# EAGLE design usb2can (EAGLE 6.3)
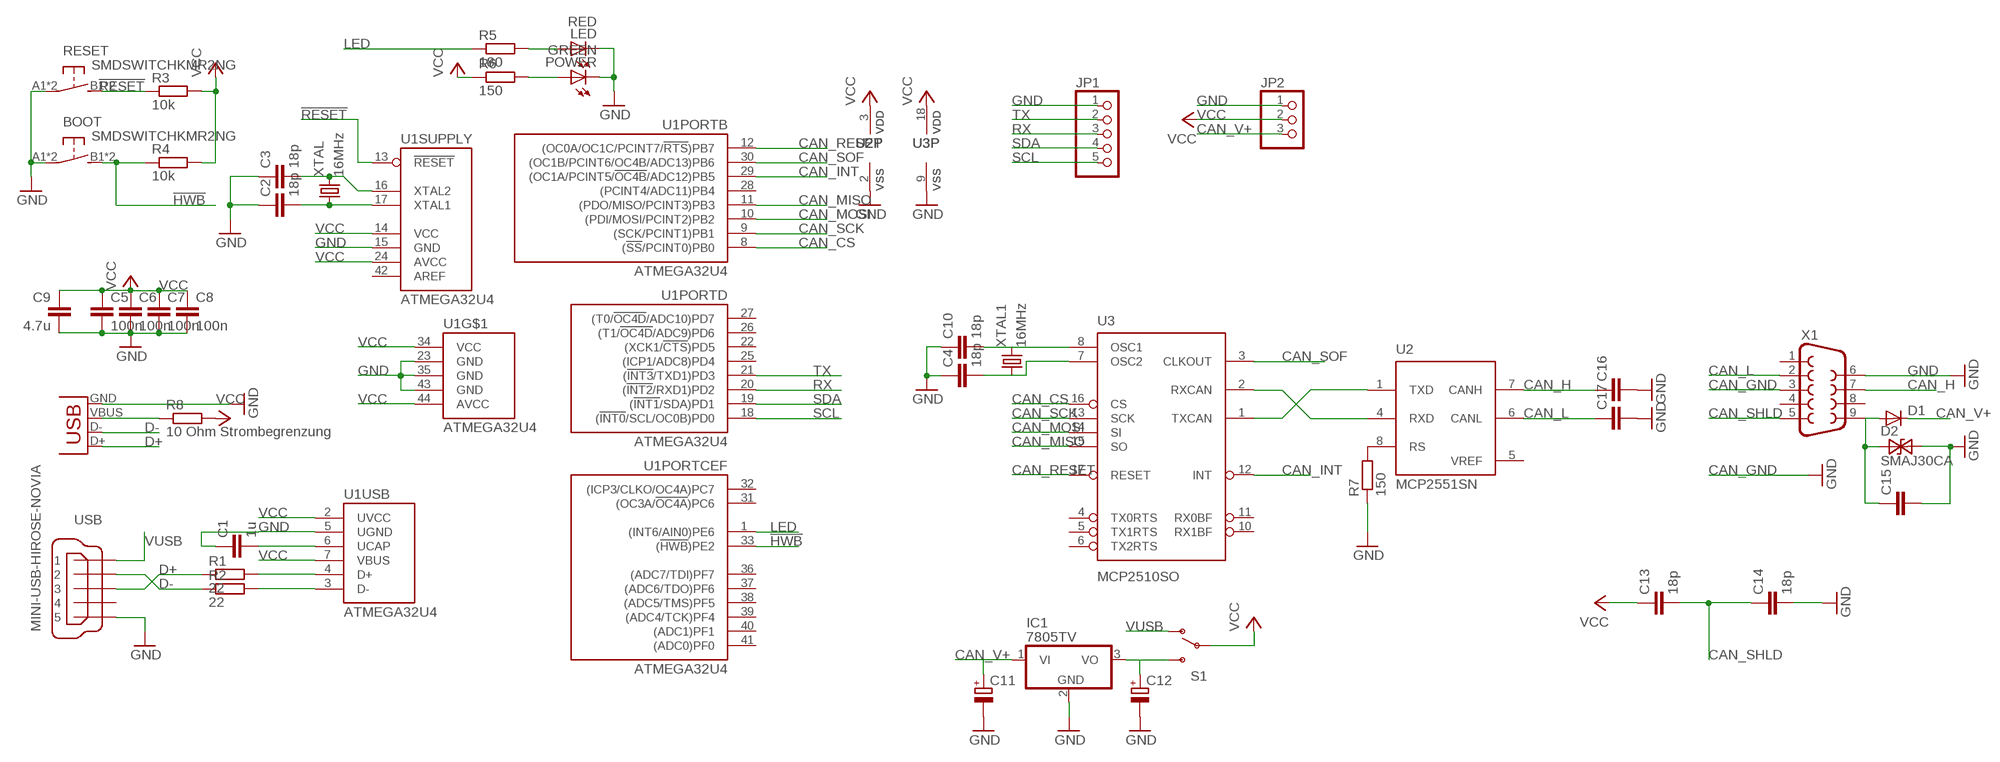
[diagram p0: schematic, sheet 1]

## Parts
BOOT  SMDSWITCHKMR2NG  [KMR2NG]
C1  1u  C-EUC0603  [C0603]
C2  18p  C-EUC0603  [C0603]
C3  18p  C-EUC0603  [C0603]
C4  18p  C-EUC0603  [C0603]
C5  100n  C-EUC0603  [C0603]
C6  100n  C-EUC0603  [C0603]
C7  100n  C-EUC0603  [C0603]
C8  100n  C-EUC0603  [C0603]
C9  4.7u  C-EUC0805K  [C0805K]
C10  18p  C-EUC0603  [C0603]
C11  CPOL-EU140CLH-1010  [140CLH-1010]
C12  CPOL-EU140CLH-1010  [140CLH-1010]
C13  18p  C-EUC0603  [C0603]
C14  18p  C-EUC0603  [C0603]
C15  C-EUC0603  [C0603]
C16  C-EUC0603  [C0603]
C17  C-EUC0603  [C0603]
D1  DIODESOD  [SOD-323]
D2  SMAJ30CA  [DO214AC]
IC1  7805TV  [TO220V]
JP1  PINHD-1X5  [1X05]
JP2  PINHD-1X3  [1X03]
LED  RED  LEDCHIPLED_0805  [CHIPLED_0805]
POWER  GREEN  LEDCHIPLED_0805  [CHIPLED_0805]
R1  22  R-EU_R0603  [R0603]
R2  22  R-EU_R0603  [R0603]
R3  10k  R-EU_R0603  [R0603]
R4  10k  R-EU_R0603  [R0603]
R5  180  R-EU_R0603  [R0603]
R6  150  R-EU_R0603  [R0603]
R7  150  R-EU_R0603  [R0603]
R8  10 Ohm Strombegrenzung  R-EU_R0603  [R0603]
RESET  SMDSWITCHKMR2NG  [KMR2NG]
S1  SWITCH-SPSTSMD2  [SWITCH-SPDT-SMD]
U1  ATMEGA32U4  ATMEGAXU4TQFP44  [TQFP44]
U2  MCP2551SN  [SO-08]
U3  MCP2510SO  [SO-18W]
USB  MINI-USB-HIROSE-NOVIA  [SMD-HIROSE-NOVIA]
X1  F09D  [F09D]
X2  USB-A-S  [USB-A-S]
XTAL  16MHz  CRYSTALABM7  [ABM7]
XTAL1  16MHz  CRYSTALABM7  [ABM7]

## Nets
!HWB: BOOT.B1(S) BOOT.B2(S) R4.1 U1.33(PORTCEF:(!HWB!)PE2)
!RESET: R3.1 RESET.B1(S) RESET.B2(S) U1.13(SUPPLY:!RESET)
CAN_CS: U1.8(PORTB:(!SS!/PCINT0)PB0) U3.16(CS)
CAN_GND: X1.3 ; supply symbol labelled GND
CAN_H: C16.1 U2.7(CANH) X1.7
CAN_INT: U1.29(PORTB:(OC1A/PCINT5/!OC4B!/ADC12)PB5) U3.12(INT)
CAN_L: C17.1 U2.6(CANL) X1.2
CAN_MISO: U1.11(PORTB:(PDO/MISO/PCINT3)PB3) U3.15(SO)
CAN_MOSI: U1.10(PORTB:(PDI/MOSI/PCINT2)PB2) U3.14(SI)
CAN_RESET: U1.12(PORTB:(OC0A/OC1C/PCINT7/!RTS!)PB7) U3.17(RESET)
CAN_SCK: U1.9(PORTB:(SCK/PCINT1)PB1) U3.13(SCK)
CAN_SHLD: X1.5
CAN_SOF: U1.30(PORTB:(OC1B/PCINT6/OC4B/ADC13)PB6) U3.3(CLKOUT)
CAN_V+: C11.+ D1.1(C) IC1.1(VI) JP2.3
D+: R1.1 USB.3 X2.D+
D-: R2.1 USB.2 X2.D-
GND: BOOT.A1(P) BOOT.A2(P) C1.1 C2.1 C3.1 C4.1 C5.2 C6.2 C7.2 C8.2 C9.2 C10.1 C11.- C12.- C14.2 C15.2 C16.2 C17.2 D2.2 IC1.2(GND) JP1.1 JP2.1 LED.C POWER.C R7.1 RESET.A1(P) RESET.A2(P) U1.5(USB:UGND) U1.15(SUPPLY:GND) U1.23(GND) U1.35(GND) U1.43(GND) U2.2(VSS) U3.9(VSS) USB.5 X1.6 X2.GND
LED: R5.1 U1.1(PORTCEF:(INT6/AIN0)PE6)
N$1: R8.1 X2.VBUS
N$2: C15.1 D1.2(A) D2.1 X1.9
N$3: C10.2 U3.8(OSC1) XTAL1.P$2
N$5: C2.2 U1.17(SUPPLY:XTAL1) XTAL.P$1
N$6: C3.2 U1.16(SUPPLY:XTAL2) XTAL.P$2
N$7: C1.2 U1.6(USB:UCAP)
N$8: POWER.A R6.2
N$9: R1.2 U1.4(USB:D+)
N$10: R2.2 U1.3(USB:D-)
N$11: LED.A R5.2
N$12: C4.2 U3.7(OSC2) XTAL1.P$1
N$13: R7.2 U2.8(RS)
N$15: C12.+ IC1.3(VO) S1.3(S)
N$16: C13.2 C14.1
N$20: U2.4(RXD) U3.2(RXCAN)
N$22: U2.1(TXD) U3.1(TXCAN)
RX: JP1.3 U1.20(PORTD:(!INT2!/RXD1)PD2)
SCL: JP1.5 U1.18(PORTD:(!INT0!/SCL/OC0B)PD0)
SDA: JP1.4 U1.19(PORTD:(!INT1!/SDA)PD1)
TX: JP1.2 U1.21(PORTD:(!INT3!/TXD1)PD3)
VCC: C5.1 C6.1 C7.1 C8.1 C9.1 C13.1 JP2.2 R3.2 R4.2 R6.1 R8.2 S1.2(P) U1.2(USB:UVCC) U1.7(USB:VBUS) U1.14(SUPPLY:VCC) U1.24(SUPPLY:AVCC) U1.34(VCC) U1.44(AVCC) U2.3(VDD) U3.18(VDD)
VUSB: S1.1(O) USB.1
Unconnected: U1.22(PORTD:(XCK1/!CTS!)PD5) U1.25(PORTD:(ICP1/ADC8)PD4) U1.26(PORTD:(T1/!OC4D!/ADC9)PD6) U1.27(PORTD:(T0/!OC4D!/ADC10)PD7) U1.28(PORTB:(PCINT4/ADC11)PB4) U1.31(PORTCEF:(OC3A/!OC4A!)PC6) U1.32(PORTCEF:(ICP3/CLKO/OC4A)PC7) U1.36(PORTCEF:(ADC7/TDI)PF7) U1.37(PORTCEF:(ADC6/TDO)PF6) U1.38(PORTCEF:(ADC5/TMS)PF5) U1.39(PORTCEF:(ADC4/TCK)PF4) U1.40(PORTCEF:(ADC1)PF1) U1.41(PORTCEF:(ADC0)PF0) U3.4(TX0RTS) U3.5(TX1RTS) U3.6(TX2RTS) U3.10(RX1BF) U3.11(RX0BF) USB.4 X1.1 X1.4 X1.8

## Power pins joined to a net without a drawn wire
AREF: U1.42(SUPPLY:AREF)
VREF: U2.5(VREF)

## Library data of the parts
BOOT RESET = jocki:SMDSWITCH
C1-C10 C13 C14 = rcl:C-EU: CAPACITOR, European symbol
C11 C12 = resistor:CPOL-EU: POLARIZED CAPACITOR, European symbol
C15-C17 = resistor:C-EU: CAPACITOR, European symbol
D1 = SparkFun (2):DIODE: Diode These are standard reverse protection diodes and small signal diodes. SMA package can handle up to about 1A. SOD-323 can handle about 200mA. What the SOD-323 package when ordering, there are some mfgs out there that are 5-pin packages.
D2 = SMAJ_suppressors_CA_A:SMAJ*CA: SMAJxxCA Series of bidirectional Transient Voltage Suppressor Diodes xx = Stand-off Voltage VR in Volts; PPM = 400 W (300 W) @ 10/1000 us; IFSM = 40 A Case: SMA (JEDEC DO-214AC) Author: Dipl.-Ing. FH Rainer Bayer, www.ing-rb.de/hhn Feedback: rainer.bayer@hs-heilbronn.de
IC1 = linear:78*: Positive VOLTAGE REGULATOR Source: http://cache.national.com/ds/LM/LM78L05.pdf http://www.fairchildsemi.com/ds/LM/LM7805.pdf
JP1 = pinhead:PINHD-1X5: PIN HEADER
JP2 = pinhead:PINHD-1X3: PIN HEADER
LED POWER = led:LED: LED OSRAM: - CHIPLED LG R971, LG N971, LY N971, LG Q971, LY Q971, LO R971, LY R971 LH N974, LH R974 LS Q976, LO Q976, LY Q976 LO Q996 - Hyper CHIPLED LW Q18S LB Q993, LB Q99A, LB R99A - SideLED LS A670, LO A670, LY A670, LG A670, LP A670 LB A673, LV A673, LT A673, LW A673 LH A674 LY A675 LS A676, LA A676, LO A676, LY A676, LW A676 LS A679, LY A679, LG A679 - Hyper Micro SIDELED® LS Y876, LA Y876, LO Y876, LY Y876 LT Y87S - SmartLED LW L88C, LW L88S LB L89C, LB L89S, LG L890 LS L89K, LO L89K, LY L89K LS L896, LA L896, LO L896, LY L896 - TOPLED LS T670, LO T670, LY T670, LG T670, LP T670 LSG T670, LSP T670, LSY T670, LOP T670, LYG T670 LG T671, LOG T671, LSG T671 LB T673, LV T673, LT T673, LW T673 LH T674 LS T676, LA T676, LO T676, LY T676, LB T676, LH T676, LSB T676, LW T676 LB T67C, LV T67C, LT T67C, LS T67K, LO T67K, LY T67K, LW E67C LS E67B, LA E67B, LO E67B, LY E67B, LB E67C, LV E67C, LT E67C LW T67C LS T679, LY T679, LG T679 LS T770, LO T770, LY T770, LG T770, LP T770 LB T773, LV T773, LT T773, LW T773 LH T774 LS E675, LA E675, LY E675, LS T675 LS T776, LA T776, LO T776, LY T776, LB T776 LHGB T686 LT T68C, LB T68C - Hyper Mini TOPLED® LB M676 - Mini TOPLED Santana® LG M470 LS M47K, LO M47K, LY M47K Source: http://www.osram.convergy.de LUXEON: - LUMILED® LXK2-PW12-R00, LXK2-PW12-S00, LXK2-PW14-U00, LXK2-PW14-V00 LXK2-PM12-R00, LXK2-PM12-S00, LXK2-PM14-U00 LXK2-PE12-Q00, LXK2-PE12-R00, LXK2-PE12-S00, LXK2-PE14-T00, LXK2-PE14-U00 LXK2-PB12-K00, LXK2-PB12-L00, LXK2-PB12-M00, LXK2-PB14-N00, LXK2-PB14-P00, LXK2-PB14-Q00 LXK2-PR12-L00, LXK2-PR12-M00, LXK2-PR14-Q00, LXK2-PR14-R00 LXK2-PD12-Q00, LXK2-PD12-R00, LXK2-PD12-S00 LXK2-PH12-R00, LXK2-PH12-S00 LXK2-PL12-P00, LXK2-PL12-Q00, LXK2-PL12-R00 Source: www.luxeon.com KINGBRIGHT: KA-3528ASYC Source: www.kingbright.com
R1-R8 = rcl:R-EU_: RESISTOR, European symbol
S1 = SparkFun (2):SWITCH-SPST: SPST Switch Simple slide switch. Spark Fun Electronics SKU : COM-00102
U1 = jocki:ATMEGAXU4: Atmel Atmega16U4 or Atmega32U4
U2 = microchip_can:MCP2551: High Speed CAN tranceiver
U3 = microchip_can:MCP2510
USB = jocki:MINI-USB-: MINI USB-B Conector Source: www.cypressindustries.com
X1 = con-subd:F09: SUB-D; OC_FARNELL: unknown; OC_NEWARK: unknown
X2 = SparkFun (2):USB: USB Connectors USB-B-PTH is fully proven SKU : PRT-00139 USB-miniB is fully proven SKU : PRT-00587 USB-A-PCB is untested. USB-A-H is throughly reviewed, but untested. Spark Fun Electronics SKU : PRT-00437 USB-B-SMT is throughly reviewed, but untested. Needs silkscreen touching up. USB-A-S has not been used/tested USB-MB-H has not been used/tested
XTAL XTAL1 = jocki:CRYSTAL

## Board
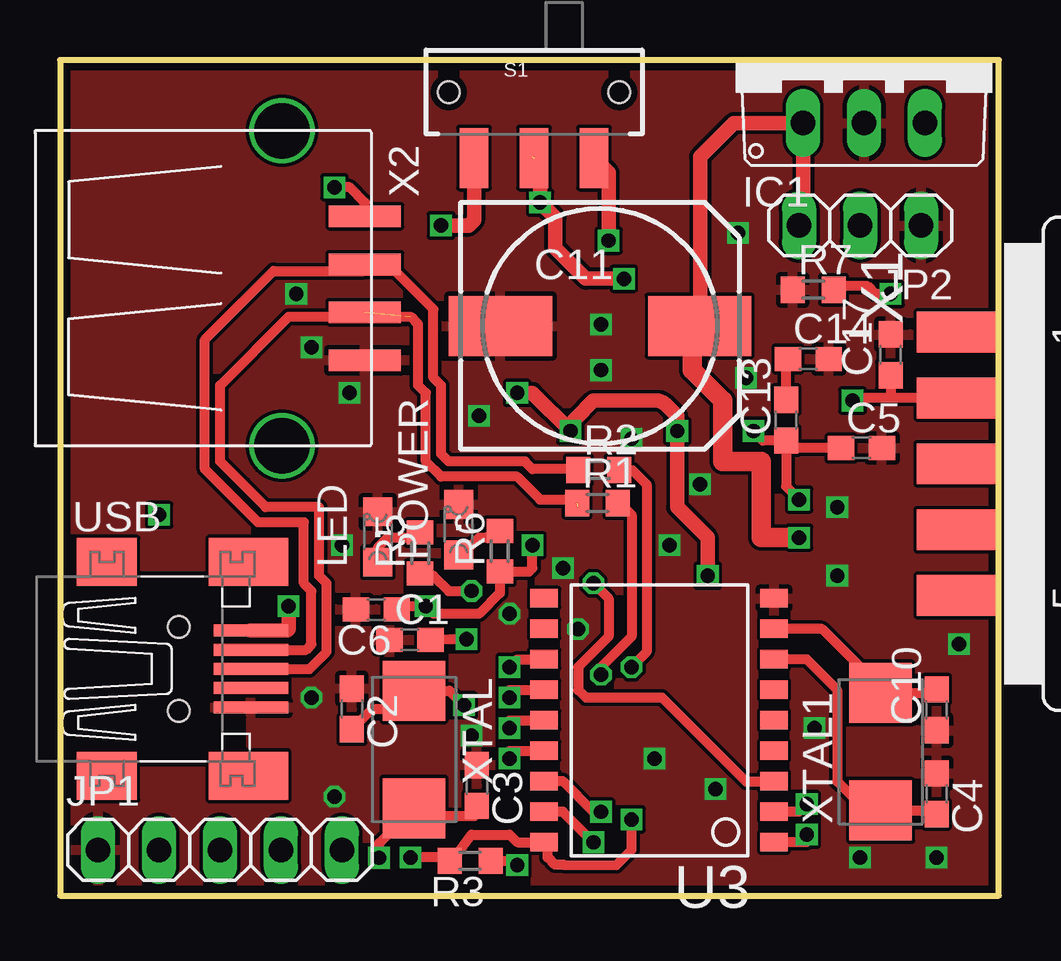
[diagram p1: board, top side]
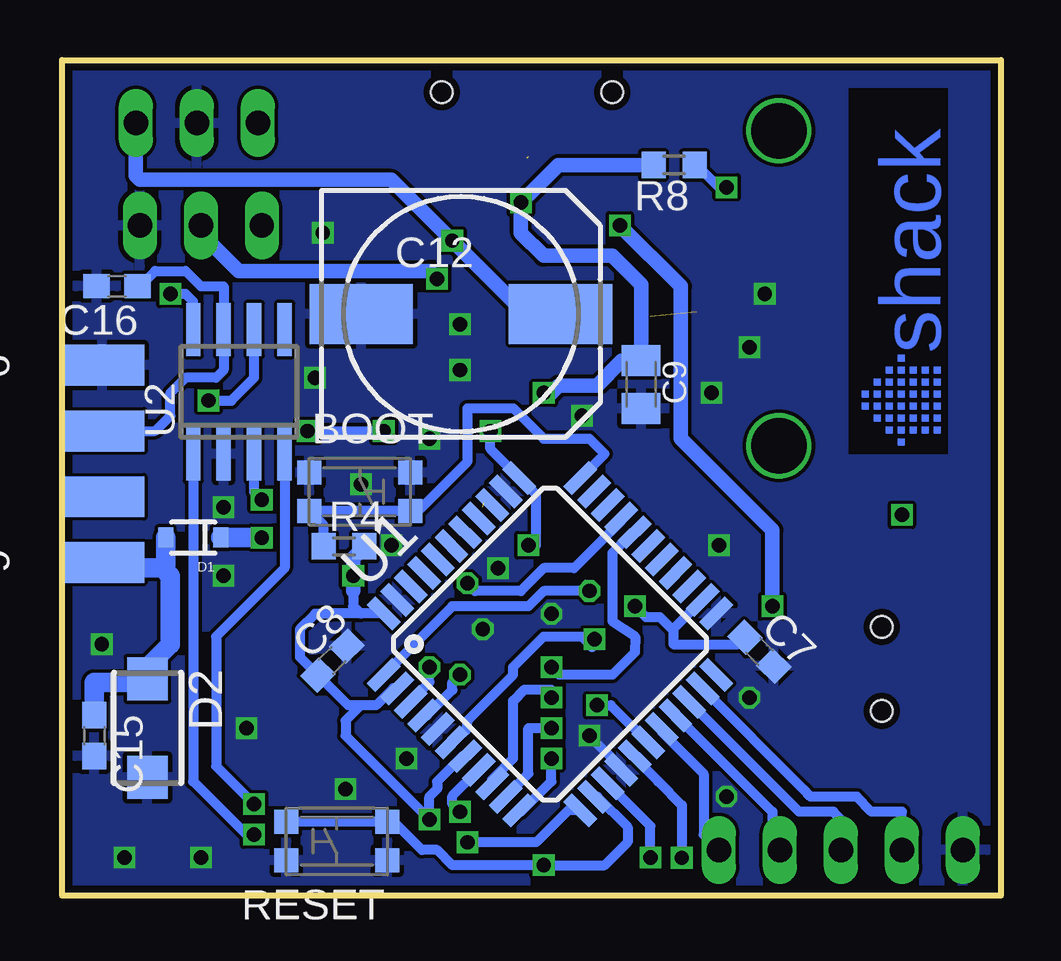
[diagram p2: board, bottom side, seen from below]

Size 39.12 x 34.84 mm. Coordinates in mm from the lower left corner, seen from the top.
Outline: 0,0 39.12,0 39.12,34.84 0,34.84 0,0
Copper layers (1*16): Top 0.035mm / dielectric 1.5mm / Bottom 0.035mm
Design rules "PCB-POOL Standard": minimum track width 0.15mm, minimum drill 0.3mm, track to track 0.15mm, track to pad 0.15mm, pad to pad 0.15mm, via to via 0.15mm, smd to smd 0.15mm, copper to edge 0.3mm, drill to drill 0.2mm, minimum pad ring 0.2mm, minimum via ring 0.15mm, stop-mask expansion 0.075mm, vias tented up to drill 0mil, thermal gap 0.2mm
bRestrict: area 2.2,18.4 to 6.3,33.7

### Footprints (pad centres in the part's own frame; a part is rotated, then mirrored left to right if it is on the bottom)
KMR2NG = smd 1 x 1: A1 -2.1,0.8; A2 2.1,0.8; B1 -2.1,-0.8; B2 2.1,-0.8
C0603 = smd 1.1 x 1: 1 -0.85,0; 2 0.85,0
C0805K = smd 1.3 x 1.6: 1 -1,0; 2 1,0
140CLH-1010 = smd 4.3 x 2.5: + 4.15,0; - -4.15,0
SOD-323 = smd 0.63 x 0.83: 1 -1.15,0; 2 1.15,0
DO214AC = smd 1.8 x 1.7: 1 -2.05,0; 2 2.05,0
TO220V = drill 1.016 long: 1 -2.54,-2.54; 2 0,-2.54; 3 2.54,-2.54
1X05 = drill 1.016 long: 1 -5.08,0; 2 -2.54,0; 3 0,0; 4 2.54,0; 5 5.08,0
1X03 = drill 1.016 long: 1 -2.54,0; 2 0,0; 3 2.54,0
CHIPLED_0805 = smd 1.2 x 1.2: A 0,-1.05; C 0,1.05
R0603 = smd 1 x 1.1: 1 -0.85,0; 2 0.85,0
SWITCH-SPDT-SMD = smd 1.2 x 2.5: 1 -2.5,-2.75; 2 0,-2.75; 3 2.5,-2.75 | hole 0.9: -3.55,0; 3.55,0
TQFP44 = smd 1.5 x 0.5: 1 -5.8,4; 2 -5.8,3.2; 3 -5.8,2.4; 4 -5.8,1.6; 5 -5.8,0.8; 6 -5.8,0; 7 -5.8,-0.8; 8 -5.8,-1.6; 9 -5.8,-2.4; 10 -5.8,-3.2; 11 -5.8,-4; 23 5.8,-4; 24 5.8,-3.2; 25 5.8,-2.4; 26 5.8,-1.6; 27 5.8,-0.8; 28 5.8,0; 29 5.8,0.8; 30 5.8,1.6; 31 5.8,2.4; 32 5.8,3.2; 33 5.8,4 | smd 0.5 x 1.5: 12 -4,-5.8; 13 -3.2,-5.8; 14 -2.4,-5.8; 15 -1.6,-5.8; 16 -0.8,-5.8; 17 0,-5.8; 18 0.8,-5.8; 19 1.6,-5.8; 20 2.4,-5.8; 21 3.2,-5.8; 22 4,-5.8; 34 4,5.8; 35 3.2,5.8; 36 2.4,5.8; 37 1.6,5.8; 38 0.8,5.8; 39 0,5.8; 40 -0.8,5.8; 41 -1.6,5.8; 42 -2.4,5.8; 43 -3.2,5.8; 44 -4,5.8
SO-08 = smd 0.6 x 2.2: 1 -1.905,-2.6; 2 -0.635,-2.6; 3 0.635,-2.6; 4 1.905,-2.6; 5 1.905,2.6; 6 0.635,2.6; 7 -0.635,2.6; 8 -1.905,2.6
SO-18W = smd 0.762 x 1.143: 1 -5.08,-4.788; 2 -3.81,-4.788; 3 -2.54,-4.788; 4 -1.27,-4.788; 5 0,-4.788; 6 1.27,-4.788; 7 2.54,-4.788; 8 3.81,-4.788; 9 5.08,-4.788; 10 5.08,4.788; 11 3.81,4.788; 12 2.54,4.788; 13 1.27,4.788; 14 0,4.788; 15 -1.27,4.788; 16 -2.54,4.788; 17 -3.81,4.788; 18 -5.08,4.788
SMD-HIROSE-NOVIA = smd 3.1 x 0.5: 1 3,1.6; 2 3,0.8; 3 3,0; 4 3,-0.8; 5 3,-1.6 | smd 2.5 x 2: M1 -3,-4.45; M2 -3,4.45 | smd 3.3 x 2: M3 2.9,4.45; M4 2.9,-4.45 | hole 0.9: 0,1.75; 0,-1.75
F09D = smd 1.7 x 3.5: 1 -5.486,-6.045; 2 -2.743,-6.045; 3 0,-6.045; 4 2.743,-6.045; 5 5.486,-6.045 | smd 1.7 x 3.5 bottom: 6 -4.115,-6.045; 7 -1.372,-6.045; 8 1.372,-6.045; 9 4.115,-6.045
USB-A-S = smd 3 x 0.9: D+ 3.45,-1; D- 3.45,1; GND 3.45,-3; VBUS 3.45,3 | drill 2.311: P$5 0,-6.566; P$6 0,6.566
ABM7 = smd 2.5 x 2.6: P$1 -2.45,0; P$2 2.45,0

### Placement (x,y rotation side)
BOOT  26.72,16.84 0 bottom
C1  14.58,10.67 0 top
C2  12.16,7.78 270 top
C3  17.37,4.59 270 top
C4  36.52,4.25 270 top
C5  33.39,18.66 0 top
C6  13.18,11.93 180 top
C7  10.07,10.17 315 bottom
C8  27.86,9.8 45 bottom
C9  14.99,21.31 270 bottom
C10  36.52,7.75 90 top
C11  22.5,23.75 0 top
C12  22.5,24.25 0 bottom
C13  30.25,19.82 90 top
C14  31.18,22.37 0 top
C15  37.78,6.67 270 bottom
C16  36.83,25.4 180 bottom
C17  34.61,22.54 90 top
D1  33.66,14.92 180 bottom
D2  35.56,6.99 270 bottom
IC1  33.5,34.75 0 top
JP1  6.67,1.91 0 top
JP2  33.34,27.94 180 top
LED  13.24,14.95 0 top
POWER  16.61,15.25 0 top
R1  22.4,16.36 0 top
R2  22.45,17.74 0 top
R3  17.09,1.45 180 top
R4  27.37,14.56 0 bottom
R5  15.01,14.28 90 top
R6  18.33,14.36 90 top
R7  31.39,25.26 0 top
R8  13.62,30.46 180 bottom
RESET  27.67,2.27 180 bottom
S1  19.75,33.5 0 top
U1  18.79,10.48 45 bottom
U2  31.75,21 0 bottom
U3  24.96,7.32 90 top
USB  4.96,9.45 0 top
X1  43.5,18 270 top
X2  9.25,25.32 0 top
XTAL  14.75,6.09 270 top
XTAL1  34.2,6 90 top

### Tracks (layer width: path | path; a pad name or v marks a point on that pad's centre or on a via)
!HWB
  Bottom 0.406: U1.33 16.51,18.41 17.14,19.05 19.05,19.05 20.32,20.32 22.23,20.32 22.23,18.1 24.29,16.04 BOOT.B2 BOOT.B1 28.22,15.44 R4.1
!RESET  (via drill 0.6)
  Top 0.406: R3.1 18.87,1.45 v19.05,1.27
  Bottom 0.406: U1.13 16.82,4.12 15.56,2.86 15.56,2.22 16.51,1.27 v19.05,1.27 22.86,1.27 23.5,1.91 24.13,1.91 25.25,3.03 RESET.B1 RESET.B2
CAN_CS  (via drill 0.6)
  Top 0.406: U3.16 20.94,4.78 22.23,3.49 v22.54,3.49
  Bottom 0.406: v22.54,3.49 22.86,3.81 22.86,4.15 U1.8
CAN_H
  Bottom 0.406: X1.7 35.24,19.37 34.61,20 34.61,20.95 33.97,21.59 32.7,21.59 32.38,21.91 U2.7 32.38,25.4 33.34,25.4 33.97,26.04 35.24,26.04 35.88,25.4 C16.1
CAN_INT  (via drill 0.6)
  Top 0.406: v18.73,9.53 19.05,9.84 19.84,9.84 U3.12
  Bottom 0.406: U1.29 15.33,15.15 16.19,14.29 16.19,11.43 15.24,10.79 15.26,10.14 16.19,9.21 18.41,9.21 v18.73,9.53
CAN_L  (via drill 0.6)
  Top 0.406: X1.2 34.61,20.74 | 34.61,20.74 33.44,20.74 33.34,20.64 v33.02,20.64 | C17.1 34.61,20.74
  Bottom 0.406: v33.02,20.64 32.07,20.64 31.11,21.59 U2.6
CAN_MISO  (via drill 0.6)
  Top 0.406: v18.73,5.71 18.73,6.03 19.84,6.03 U3.15
  Bottom 0.406: v18.73,5.71 18.73,4.76 20,3.49 U1.11
CAN_MOSI  (via drill 0.6)
  Top 0.406: v18.73,6.99 18.73,7.3 19.84,7.3 U3.14
  Bottom 0.406: U1.10 20.63,4.13 19.68,5.08 19.68,6.99 v18.73,6.99
CAN_RESET  (via drill 0.6)
  Top 0.406: v22.23,2.22 20.95,3.49 20.19,3.49 U3.17
  Bottom 0.406: U1.12 18.04,3.55 19.37,2.22 v22.23,2.22
CAN_SCK  (via drill 0.6)
  Top 0.406: v18.73,8.26 18.73,8.57 19.84,8.57 U3.13
  Bottom 0.406: U1.9 21.2,4.84 20.32,5.71 20.32,8.12 19.86,8.59 18.75,8.59 v18.73,8.26
CAN_SOF  (via drill 0.6)
  Top 0.406: v22.23,13.02 22.86,12.38 22.86,10.79 21.59,9.53 21.59,8.57 21.91,8.26 25.08,8.26 28.57,4.76 29.73,4.76 U3.3
  Bottom 0.406: U1.30 15.82,15.61 17.78,13.65 19.05,13.65 20,12.7 21.91,12.7 v22.23,13.02
CAN_V+  (via drill 0.6)
  Top 0.61: 26.35,23.45 C11.+ 26.67,23.77 26.67,30.8 28.08,32.21 IC1.1 30.96,28.1 JP2.3
  Top 0.813: 26.35,23.45 26.35,21.91 27.62,20.64 27.62,18.1 29.21,18.1 29.21,14.92 v30.8,14.92
  Bottom 0.813: D1.1 v30.8,14.92
D+  (2 unrouted)
  Top 0.406: USB.3 10.4,9.45 11.11,10.16 11.11,13.02 10.79,13.34 10.79,16.19 8.57,16.19 6.67,18.1 6.67,21.27 9.53,24.13 14.61,24.13 14.92,23.81 14.92,21.27 15.24,20.95 15.24,18.1 15.88,17.46 19.05,17.46 20,16.51 21.27,16.51 21.59,16.19 | 12.7,24.13 X2.D+
D-
  Top 0.406: USB.2 10.25,10.25 10.48,10.48 10.48,12.7 10.16,13.02 10.16,15.56 8.26,15.56 6.03,17.78 6.03,23.18 8.89,26.04 12.66,26.04 X2.D- 12.7,26.04 13.97,26.04 15.56,24.45 15.56,21.59 15.88,21.27 15.88,18.41 16.19,18.1 19.37,18.1 19.68,17.78 21.59,17.78 R2.1
GND  (via drill 0.6)
  Top 0.406: v17.14,6.67 17.14,6.62
  Bottom 0.406: U1.15 15.82,5.34 v17.14,6.67
  other vias: 32.38,16.19 32.38,13.34 12.06,20.95 17.46,20 11.75,14.61 23.81,19.05 36.51,1.59 28.26,27.62 22.54,23.81 22.54,21.91 9.84,25.08 10.48,22.86 10.48,8.26 20.95,13.65 37.47,10.48 18.73,11.75 11.43,4.13 24.77,5.71 27.3,4.45 31.43,6.99 33.34,1.59 28.57,21.59 26.67,17.14 25.4,14.61 21.59,11.11
  pour Bottom: 0,0 39.05,0 39.05,34.92 0,34.92
  pour Top: 0,0 39.05,0 39.05,34.92 0,34.92
LED  (via drill 0.6)
  Top 0.406: v17.14,12.7 16.19,12.7 15.56,13.34 15.1,13.34 R5.1
  Bottom 0.406: v17.14,12.7 19.05,12.7 19.68,12.06 22.87,12.06 U1.1
N$1  (via drill 0.6)
  Top 0.406: X2.VBUS 12.7,28.89 12.06,29.53 v11.43,29.53
  Bottom 0.406: v11.43,29.53 11.75,29.53 12.7,30.48 12.75,30.48 R8.1
N$2
  Bottom 0.813: D1.2 34.8,13.77 34.92,13.65 | 34.92,13.65 37.22,13.65 X1.9 | D2.1 36.05,9.04 | 36.05,9.04 34.61,10.48 34.61,13.34 34.92,13.65 | C15.1 37.78,8.89 36.2,8.89 36.05,9.04
N$3
  Top 0.406: C10.2 36.38,8.45 XTAL1.P$2 33.88,8.98 31.75,11.11 29.45,11.11 U3.8
N$4GND  (via drill 0.6)
  other vias: 4.13,15.88
N$5  (via drill 0.6)
  Top 0.406: C2.2 13.02,7.79 14,7.79 XTAL.P$1 16.22,8.54 v16.83,7.94
  Bottom 0.406: v16.83,7.94 16.25,7.94 U1.17
N$6  (via drill 0.6)
  Top 0.406: v13.3,1.57 13.3,2.19 13.65,2.54 14.25,3.78 XTAL.P$2 15.39,3.33 16.98,3.33 | 16.98,3.35 C3.2 17.27,3.33 16.98,3.33 | 16.98,3.33 17.14,3.49
  Bottom 0.406: U1.16 15.26,5.76 14.29,4.76 13.3,3.77 v13.3,1.57
N$7  (via drill 0.6)
  Top 0.406: v16.93,10.68 16.27,10.68 C1.2
  Bottom 0.406: U1.6 22.26,6.92 22.23,7.3 20.32,9.21 20.32,9.53 19.05,10.79 17.46,10.79 17.03,10.37 v16.93,10.68
N$8
  Top 0.406: POWER.A 16.61,14.07 17.46,14.92 17.73,14.92 R6.2
N$9  (via drill 0.6)
  Top 0.406: R1.2 23.32,16.36 23.81,15.88 23.81,10.79 22.54,9.53 v22.54,9.21
  Bottom 0.406: U1.4 23.92,7.51 22.86,8.57 22.86,8.89 v22.54,9.21
N$10  (via drill 0.6)
  Top 0.406: v23.81,9.53 24.45,10.16 24.45,17.14 23.85,17.74 R2.2
  Bottom 0.406: U1.3 24.59,8.11 23.81,8.89 v23.81,9.53
N$11
  Top 0.406: LED.A 13.24,14.51 13.65,14.92 14.61,14.92 14.92,15.24 15.01,15.15 R5.2
N$12
  Top 0.406: XTAL1.P$1 36.38,3.55 C4.2 | U3.7 31.1,9.86 32.38,8.57 32.38,4.76 33.66,3.49 34.14,3.49 XTAL1.P$1 | 36.68,3.49 XTAL1.P$1
N$13  (via drill 0.6)
  Top 0.406: v34.61,25.08 33.97,25.08 33.66,25.4 32.38,25.4 R7.2
  Bottom 0.406: U2.8 33.66,24.77 33.97,25.08 v34.61,25.08
N$15  (via drill 0.6)
  Top 0.61: v22.86,27.3 22.86,30.14 S1.3
  Bottom 0.61: C12.+ 19.8,24.25 v22.86,27.3 25.4,29.84 35.88,29.84 36.04,30.01 IC1.3
N$16
  Top 0.406: C13.2 30.25,22.29 C14.1
N$20  (via drill 0.6)
  Top 0.406: v31.11,3.81 30.8,3.49 29.45,3.49 U3.2
  Bottom 0.406: U2.4 29.84,13.65 32.7,10.79 32.7,5.4 v31.11,3.81
N$22  (via drill 0.6)
  Top 0.406: U3.1 31.1,2.24 v31.11,2.54
  Bottom 0.406: U2.1 33.66,4.76 31.43,2.54 v31.11,2.54
RX
  Bottom 0.406: JP1.3 6.67,3.17 6.99,3.49 8.41,3.49 U1.20
SCL
  Bottom 0.406: U1.18 14.12,6.82 12.38,5.08 12.38,2.54 JP1.5
SDA
  Bottom 0.406: U1.19 13.54,7.51 9.53,3.49 9.53,2.22 JP1.4
TX
  Bottom 0.406: JP1.2 4.13,3.49 5.4,3.49 6.01,4.13 7.94,4.13 8.26,4.45 U1.21
VCC  (via drill 0.6)  (1 unrouted)
  Top 0.406: v19.68,14.61 19.68,13.65 19.54,13.51 R6.1 18.33,12.61 17.46,11.75 15.56,11.75 v15.24,12.06 14.29,12.06 13.97,11.75 13.97,11.79 arc-45 C6.1 | v23.81,3.17 23.81,1.91 23.18,1.27 20.97,1.28 20.62,1.28 20.32,1.59 20.32,2.09 U3.18 20.16,2.22 19.05,2.22 18.73,2.54 17.14,2.54 16.24,1.31 | R3.2 16.24,1.31 | 16.24,1.31 15.88,1.59 v14.61,1.59 | v21.27,19.37 21.27,19.42 | C13.1 29.29,18.97 v28.89,19.37 | C13.1 30.25,17.05 v30.8,16.51 | C5.1 30.57,18.66 C13.1
  Top 0.61: 19.68,30.8 20,30.48 v20,28.89 20.64,28.26 20.64,26.99 21.91,25.72 v23.5,25.72 | v19.05,20.95 19.68,20.95 v21.27,19.37 | 21.27,19.42 arc-45 21.46,19.87 22.23,20.64 24.82,20.64 arc-45 25.27,20.45 25.72,20 v25.72,19.37 25.72,16.19 26.99,14.92 v26.99,13.34
  Bottom 0.406: v19.68,14.61 19.37,14.61 19.37,16.71 U1.34 21.27,18.62 v21.27,19.37 | U1.7 22.44,5.82 23.5,4.76 23.5,4.45 23.81,4.13 v23.81,3.17 27.3,6.67 27.3,7.3 26.67,7.94 | U1.2 25.33,8.64 26.04,7.94 26.67,7.94 | 26.67,7.94 27.2,7.94 C8.1 29.21,9.95 29.21,11.11 28.57,11.75 27.94,11.75 27.93,11.76 26.67,11.76 | U1.44 26.67,11.76 | U1.24 12.45,12.32 13.65,11.11 | 13.65,11.11 13.65,10.48 10.96,10.48 C7.1 | v14.61,1.59 14.61,2.9 U1.14 | 13.65,11.11 13.71,11.11 14.21,11.62 14.79,11.62 v15.24,12.06 | 26.99,12.7 26.99,12.07 26.67,11.76 | v28.89,19.37 v25.72,19.37 | v30.8,16.51 31.11,16.83 U2.3
  Bottom 0.61: R8.2 18.43,30.46 v20,28.89 20,27.62 19.05,26.67 16.19,26.67 14.99,25.47 C9.1 15.79,22.31 16.83,21.27 18.41,21.27 18.73,20.95 v19.05,20.95 | JP2.2 33.34,27.62 31.75,26.04 23.81,26.04 v23.5,25.72 | R4.2 26.99,14.07 v26.99,13.34 26.99,12.7
VUSB  (via drill 0.6)
  Top 0.61: S1.1 17.25,28.15 17.04,27.94 v15.88,27.94 | USB.1 9.46,11.05 9.53,11.11 v9.53,12.06
  Bottom 0.61: v9.53,12.06 9.53,15.24 13.34,19.05 13.34,25.4 v15.88,27.94
(copper drawn outside any net)
  shapes: Bottom area x38

### Text on the board
Bottom: shack
Reference: BOOT | RESET